# EAGLE schematic SAMD21 (EAGLE 6.5.0)
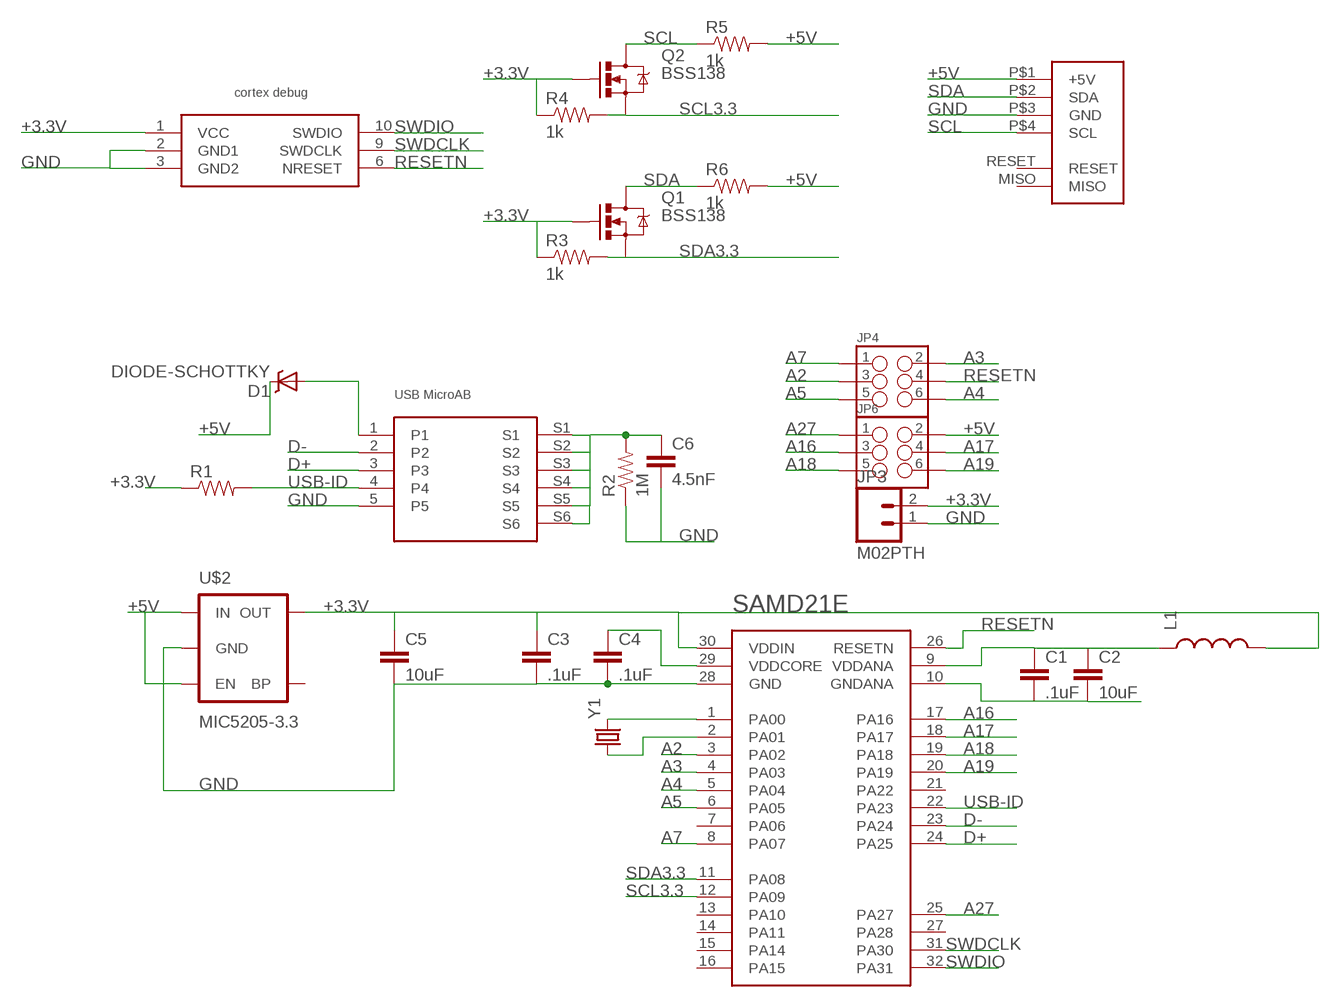
[diagram p0: schematic, sheet 1]

## Parts
C1  .1uF  CAP0805  [0805]
C2  10uF  CAP0805  [0805]
C3  .1uF  CAP0805  [0805]
C4  .1uF  CAP0805  [0805]
C5  10uF  CAP0805  [0805]
C6  4.5nF  CAP0805  [0805]
D1  DIODE-SCHOTTKY  [SOD-523]
JP3  M02PTH  [1X02]
JP4  M03X22X3_SILK_SM  [2X3]
JP6  M03X22X3_SILK_SM  [2X3]
L1  INDUCTOR0805  [0805]
Q1  BSS138  MOSFET-NCHANNELBSS138  [SOT23]
Q2  BSS138  MOSFET-NCHANNELBSS138  [SOT23]
R1  RESISTOR0805-RES  [0805]
R2  1M  RESISTOR0805-RES  [0805]
R3  1k  RESISTOR0805-RES  [0805]
R4  1k  RESISTOR0805-RES  [0805]
R5  1k  RESISTOR0805-RES  [0805]
R6  1k  RESISTOR0805-RES  [0805]
U$1  SAMD21E  [TQFP-32]
U$2  MIC5205-3.3  V_REG_MIC52053.3V  [SOT23-5]
U$3  USB-MICRO-AB  [MOLEX-MICROAB]
U$4  FOOTPRINT  [FOOTPRINT]
U$5  CORTEX-DEBUG  [HEADER-10-.05]
Y1  CRYSTALTXC-7A  [CRYSTAL-TXC-7A]

## Nets
+3.3V: C3.1 C5.1 JP3.2 L1.2 Q1.1(G) Q2.1(G) R1.1 R3.1 R4.1 U$1.30(VDDIN) U$2.5(OUT) U$5.1(VCC)
+5V: D1.C JP6.2 R5.2 R6.2 U$2.1(IN) U$2.3(EN) U$4.P$1(+5V)
A2: JP4.3 U$1.3(PA02)
A3: JP4.2 U$1.4(PA03)
A4: JP4.6 U$1.5(PA04)
A5: JP4.5 U$1.6(PA05)
A7: JP4.1 U$1.8(PA07)
A16: JP6.3 U$1.17(PA16)
A17: JP6.4 U$1.18(PA17)
A18: JP6.5 U$1.19(PA18)
A19: JP6.6 U$1.20(PA19)
A27: JP6.1 U$1.25(PA27)
D+: U$1.24(PA25) U$3.3
D-: U$1.23(PA24) U$3.2
GND: C3.2 C4.2 C5.2 C6.2 JP3.1 R2.1 U$1.28(GND) U$2.2(GND) U$3.5 U$4.P$3(GND) U$5.2(GND1) U$5.3(GND2)
N$1: C1.1 C2.1 L1.1 U$1.9(VDDANA)
N$2: C1.2 C2.2 U$1.10(GNDANA)
N$3: C6.1 R2.2 U$3.S1 U$3.S2 U$3.S3 U$3.S4 U$3.S5 U$3.S6
N$4: D1.A U$3.1
N$5: C4.1 U$1.29(VDDCORE)
N$7: U$1.1(PA00) Y1.P$2
N$8: U$1.2(PA01) Y1.P$1
RESETN: JP4.4 U$1.26(RESETN) U$5.6(NRESET)
SCL: Q2.3(D) R5.1 U$4.P$4(SCL)
SCL3.3: Q2.2(S) R4.2 U$1.12(PA09)
SDA: Q1.3(D) R6.1 U$4.P$2(SDA)
SDA3.3: Q1.2(S) R3.2 U$1.11(PA08)
SWDCLK: U$1.31(PA30) U$5.9(SWDCLK)
SWDIO: U$1.32(PA31) U$5.10(SWDIO)
USB-ID: R1.2 U$1.22(PA23) U$3.4
Unconnected: U$1.7(PA06) U$1.13(PA10) U$1.14(PA11) U$1.15(PA14) U$1.16(PA15) U$1.21(PA22) U$1.27(PA28) U$2.4(BP) U$4.MISO U$4.RESET

## Library data of the parts
C1-C6 = SparkFun-Capacitors:CAP: Capacitor Standard 0603 ceramic capacitor, and 0.1" leaded capacitor.
D1 = SparkFun-DiscreteSemi:DIODE-SCHOTTKY: Commonly MBRA140.
JP3 = SparkFun-Connectors:M02: Standard 2-pin 0.1" header. Use with - straight break away headers ( PRT-00116) - right angle break away headers (PRT-00553) - swiss pins (PRT-00743) - machine pins (PRT-00117) - female headers (PRT-00115) Molex polarized connector foot print use with: PRT-08233 with associated crimp pins and housings. 2.54_SCREWTERM for use with PRT-10571. 3.5mm Screw Terminal footprints for PRT-08084 5mm Screw Terminal footprints for use with PRT-08433
JP4 JP6 = SparkFun-Connectors:M03X2: 2x3 .1" header. Shrouded, with keying- CONN-10681 SMT- CONN-11415 Pogo pins- HW-11044
L1 = SparkFun-Passives:INDUCTOR: Inductors Basic Inductor/Choke - 0603 and 1206. Footprints are not proven and vary greatly between part numbers. SRN6045- 33uH, 20% 1.4A SDR0403-560KL - 56uH, 10%, 500mA RMS/740mA peak
Q1 Q2 = SparkFun-DiscreteSemi:MOSFET-NCHANNEL: Common NMOSFET Parts MFG P/N Store ID Prod ID FDD8780 TRANS-09984 SI7820DN TRANS-11055 FDS6630A IC-08089 2N7002PW TRANS-11151 FQP30N06L COM-10213 TRANS-10060 BSS123LT1G TRANS-08345 BSS138 TRANS-00830 BS170 2N7000; PROD_ID: TRANS-00830
R1-R6 = SparkFun-Resistors:RESISTOR: Resistor Basic schematic elements and footprints for 0603, 1206, and PTH resistors.
U$1 = IntegerLabs:SAMD21E
U$2 = SparkFun-PowerIC:V_REG_MIC5205: V_REG MIC5219 Standard 3.3V and 5V 150mA LDO voltage regulator in SOT-23 layout. Micrel part MIC5205. BP (by-pass) pin is used to lower output noise with 470pF cap, may be left open.; PROD_ID: VREG-00822; VALUE: 3.3V/150mA
U$3 = IntegerLabs:USB-MICRO-AB
U$4 = IntegerLabs:FOOTPRINT
U$5 = IntegerLabs:CORTEX-DEBUG
Y1 = SparkFun-FreqCtrl:CRYSTAL: Various standard crystals. Proven footprints. Spark Fun Electronics SKU : COM-00534